# Altium schematic sheet AudioAmplifier.SchDoc
size A4
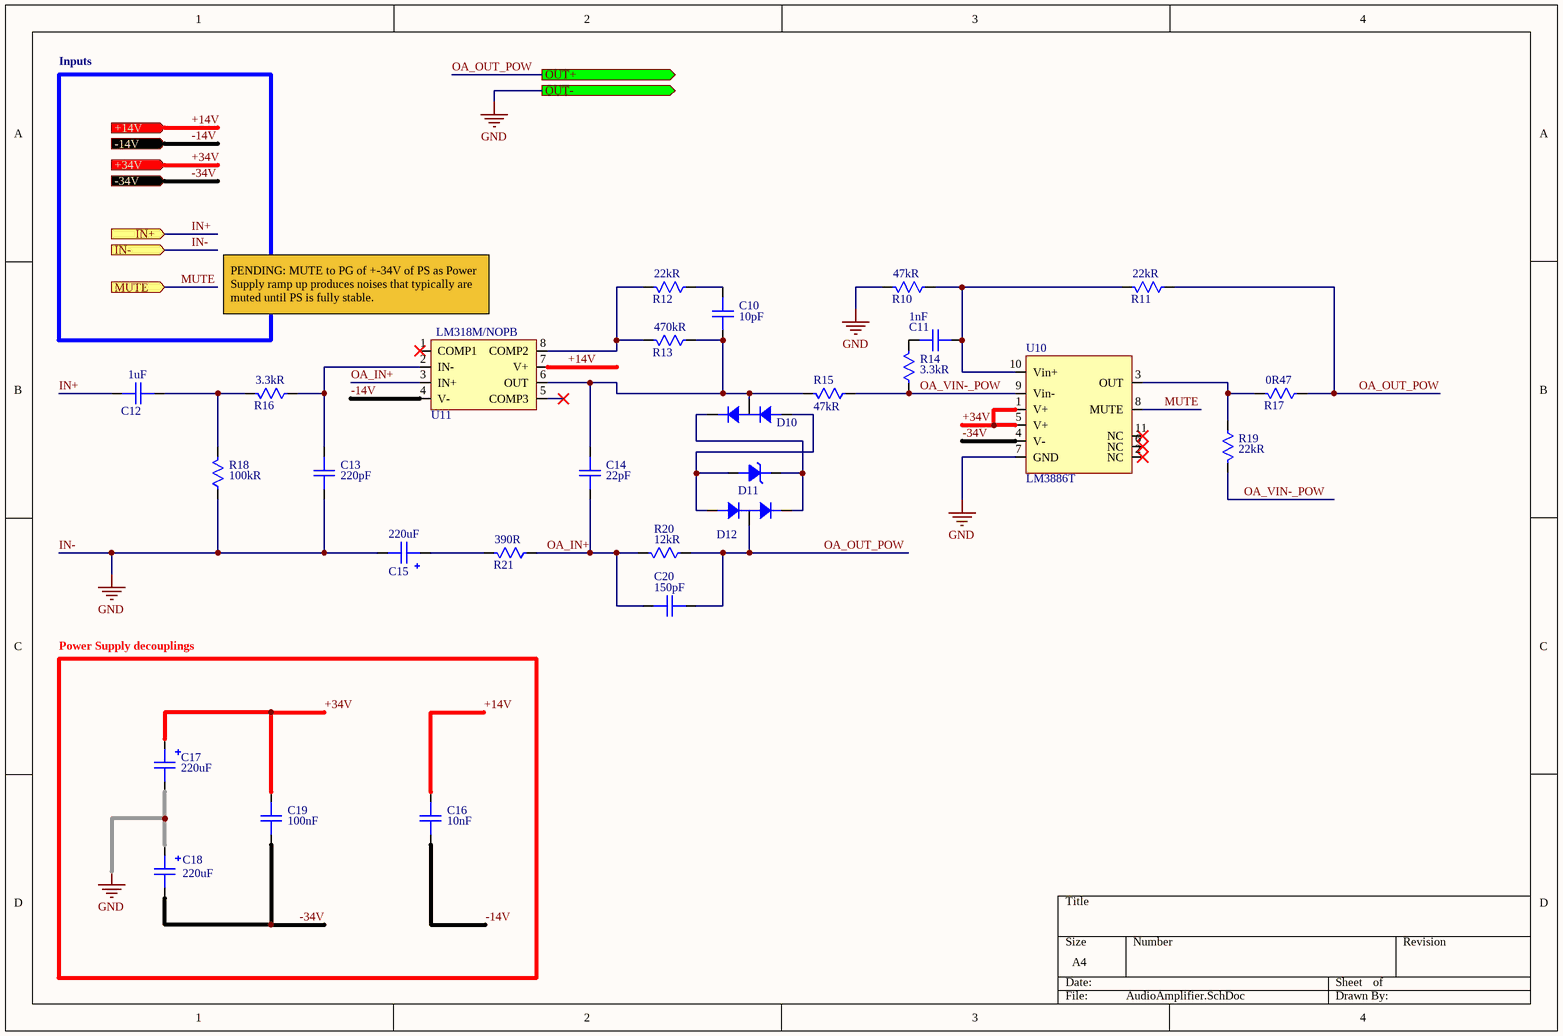
[diagram p0: AudioAmplifier.SchDoc]

## Parts
C10  Capacitance: 10pF  [CAPC2012X10N-GRM0805-MURATA]  (hidden comment: GRM21A5C2D100JW01D)
C11  Capacitance: 1nF  [CAPC2012X10N-GRM0805-MURATA]  (hidden comment: GRM219R72A102KA01D)
C12  Capacitance: 1uF  [Chip2PinSM127P600-8N-4030-SMD-PET-WIMA]  (hidden comment: SMDTC04100VA00KR00)
C13  Capacitance: 220pF  [CAPC2012X10N-GRM0805-MURATA]  (hidden comment: GRM219R72A221KA01D)
C14  Capacitance: 22pF  [CAPC2012X10N-GRM0805-MURATA]  (hidden comment: GRM21A5C2D220JW01D)
C15  Capacitance: 220uF  [Capacitor-KEMET-H4]  (hidden comment: ESH227M063AH4AA)
C16  Capacitance: 10nF  [CAPC2012X10N-GRM0805-MURATA]  (hidden comment: GRM219R72A103KA01D)
C17  Capacitance: 220uF  [Capacitor-KEMET-H4]  (hidden comment: ESH227M063AH4AA)
C18  Capacitance: 220uF  [Capacitor-KEMET-H4]  (hidden comment: ESH227M063AH4AA)
C19  Capacitance: 100nF  [CAPC2012X10N-GRM0805-MURATA]  (hidden comment: GRM21BR72A104KAC4L)
C20  Capacitance: 150pF  [CAPC2012X10N-GRM0805-MURATA]  (hidden comment: GRM2165C2A151JA01D)
D10  BAV99W,LF  [SOT65P210X100-3N-SOT-323-TOSHIBA]  (value not drawn)
D11  BZV55-C27,115  [DIOMELF3515N-SOD80C-NEXPERIA]  (value not drawn)
D12  BAV99W,LF  [SOT65P210X100-3N-SOT-323-TOSHIBA]  (value not drawn)
R10  Resistance: 47kR  [Chip2PinSM127P600-8N-RK73H-1206-KOA]  (hidden comment: RK73H2BTTD4702F)
R11  Resistance: 22kR  [Chip2PinSM127P600-8N-RK73H-1206-KOA]  (hidden comment: RK73B2BTTDD223J)
R12  Resistance: 22kR  [Chip2PinSM127P600-8N-RK73H-1206-KOA]  (hidden comment: RK73B2BTTDD223J)
R13  Resistance: 470kR  [Chip2PinSM127P600-8N-RK73H-1206-KOA]  (hidden comment: SG732BTTD474K)
R14  Resistance: 3.3kR  [Chip2PinSM127P600-8N-RK73H-1206-KOA]  (hidden comment: RK73B2BTTDD332J)
R15  Resistance: 47kR  [Chip2PinSM127P600-8N-RK73H-1206-KOA]  (hidden comment: RK73H2BTTD4702F)
R16  Resistance: 3.3kR  [Chip2PinSM127P600-8N-RK73H-1206-KOA]  (hidden comment: RK73B2BTTDD332J)
R17  Resistance: 0R47  [Chip2PinSM127P600-8N-RWS7-OHMITE]  (hidden comment: RWS7 R47 J T&R)
R18  Resistance: 100kR  [Chip2PinSM127P600-8N-RK73H-1206-KOA]  (hidden comment: RK73B2BTTDD104J)
R19  Resistance: 22kR  [Chip2PinSM127P600-8N-RK73H-1206-KOA]  (hidden comment: RK73B2BTTDD223J)
R20  Resistance: 12kR  [Chip2PinSM127P600-8N-RK73H-1206-KOA]  (hidden comment: RK73H2BTTD1202F)
R21  Resistance: 390R  [Chip2PinSM127P600-8N-RK73H-1206-KOA]  (hidden comment: RK73B2BTTDD391J)
U10  LM3886T  [TF11B]
U11  LM318M/NOPB  [SOIC127P600X175-8N-SOIC8-D0008A-TI]

## Blocks framed on the sheet
Power Supply decouplings: C16-C19

## Ports
+14V (in), +34V (in), -14V (in), -34V (in), IN+ (in), IN- (in), MUTE (in), OUT+ (out), OUT- (out)

## Nets
IN-: C13.1 C15.2 C17.2 C18.1 R10.1 R18.2 U10.7(GND) ; port IN-, port OUT-  [also labelled GND]
+14V: C16.2 U11.7(V+) ; port +14V
+34V: C17.1 C19.2 U10.1(V+) U10.5(V+) ; port +34V
-14V: C16.1 U11.4(V-) ; port -14V
-34V: C18.2 C19.1 U10.4(V-) ; port -34V
IN+: C12.2 ; port IN+
MUTE: U10.8(MUTE) ; port MUTE
OA_IN+: C14.2 C20.2 R20.1 R21.2 U11.3(IN+)
OA_OUT_POW: C20.1 D12.K1A2 R11.2 R17.2 R20.2 ; port OUT+
OA_VIN-_POW: R14.2 R15.2 R19.1 U10.9(Vin-)
NetC10_1: C10.1 C14.1 D10.K1A2 R13.2 R15.1 U11.6(OUT)
NetC10_2: C10.2 R12.2
NetC11_1: C11.1 R10.2 R11.1 U10.10(Vin+)
NetC11_2: C11.2 R14.1
NetC12_1: C12.1 R16.1 R18.1
NetC13_2: C13.2 R16.2 U11.2(IN-)
NetC15_1: C15.1 R21.1
NetD10_A1: D10.A1 D11.A D12.A1
NetD10_K2: D10.K2 D11.K D12.K2
NetR12_1: R12.1 R13.1 U11.8(COMP2)
NetR17_1: R17.1 R19.2 U10.3(OUT)

Not connected (* = marked no-connect by the designer): U10 2(NC)* 6(NC)* 11(NC)*; U11 1(COMP1)* 5(COMP3)*

## Notes on the sheet
- Inputs
- (near U11) PENDING: MUTE to PG of +-34V of PS as Power Supply ramp up produces noises that typically are muted until PS is fully stable.

## Library data of the parts
C10 = GRM21A5C2D100JW01D: Cap Ceramic 10pF 200V C0G 5% Pad SMD 0805 125C T/R; Manufacturer: Murata; Supplier 1: Arrow Electronics; Manufacturer Part Number: GRM21A5C2D100JW01D; RoHS: Yes; Category: Ceramic Capacitors; Stock 1: 3605; Pricing 1: 1=0.27880, 10=0.18960, 25=0.18290, 100=0.10650, 250=0.10520, 500=0.07580, 1000=0.06340, 3000=0.06300 (USD); Mount: Surface Mount; Case/Package: 0805; Min Operating Temperature: -55°C; Max Operating Temperature: 125°C; Packaging: Tape and Reel; Voltage Rating: 200V; Tolerance: 5%; Voltage Rating (DC): 200V; Dielectric: C0G; Length: 0.079inch; Width: 0.049inch; Thickness: 0.051inch; RoHS Compliant: Yes; ComponentLink1URL: https://search.murata.co.jp/Ceramy/image/img/A01X/G101/ENG/GRM21A5C2D100JW01-01.pdf?src-supplier=Digi-Key; ComponentLink1Description: https://search.murata.co.jp/Ceramy/image/img/A01X/G101/ENG/GRM21A5C2D100JW01-01.pdf?src-supplier=Digi-Key; ComponentLink2URL: http://search.murata.co.jp/Ceramy/image/img/A01X/G101/ENG/GRM21A5C2D100JW01-01.pdf?src-supplier=Digi-Key; ComponentLink2Description: http://search.murata.co.jp/Ceramy/image/img/A01X/G101/ENG/GRM21A5C2D100JW01-01.pdf?src-supplier=Digi-Key
C11 = GRM219R72A102KA01D: 0805 1 nF 100 V ±10 % Tolerance X7R Surface Mount Multilayer Ceramic Capacitor; Manufacturer: Murata; Voltage Rating: 100V; Tolerance: 10%; Dissipation Factor: 0.025%; Supplier 1: Arrow Electronics; Manufacturer Part Number: GRM219R72A102KA01D; RoHS: Yes; Category: Ceramic Capacitors; Stock 1: 2320; Pricing 1: 1=0.16850, 10=0.12550, 25=0.12080, 100=0.06030, 250=0.05970, 500=0.04130, 1000=0.03450 (USD); Mount: Surface Mount; Case/Package: 0805; Case Code (Metric): 2012; Case Code (Imperial): 0805; Material: Ceramic; Dielectric Material: Ceramic; Min Operating Temperature: -55°C; Max Operating Temperature: 125°C; Package Quantity: 4000; Packaging: Tape and Reel; Voltage Rating (DC): 100V; Dielectric: X7R; Termination: SMD/SMT; Voltage: 100V; Series: GRM; Construction: Flat; Length: 2mm; Width: 0.049inch; Height: 0.85mm; Thickness: 0.037inch; Depth: 1.25mm; Radiation Hardening: No; Lead Free: Lead Free; RoHS Compliant: Yes; ComponentLink1URL: https://datasheet.ciiva.com/5418/product-5418996.pdf?src-supplier=Mouser; ComponentLink1Description: https://datasheet.ciiva.com/5418/product-5418996.pdf?src-supplier=Mouser; ComponentLink2URL: https://datasheet.ciiva.com/29200/452953-da-01-en-vs-kondensator-0805-29200622.pdf?src-supplier=Conrad; ComponentLink2Description: https://datasheet.ciiva.com/29200/452953-da-01-en-vs-kondensator-0805-29200622.pdf?src-supplier=Conrad; ComponentLink3URL: https://datasheet.ciiva.com/166/partnumbering-e-01-166386.pdf?src-supplier=Digi-Key; ComponentLink3Description: https://datasheet.ciiva.com/166/partnumbering-e-01-166386.pdf?src-supplier=Digi-Key; ComponentLink4URL: https://datasheet.ciiva.com/11621/c02e-11621626.pdf?src-supplier=Avnet; ComponentLink4Description: https://datasheet.ciiva.com/11621/c02e-11621626.pdf?src-supplier=Avnet; ComponentLink5URL: https://datasheet.ciiva.com/2989/c02e-2989678.pdf?src-supplier=Avnet; ComponentLink5Description: https://datasheet.ciiva.com/2989/c02e-2989678.pdf?src-supplier=Avnet
C12 = SMDTC04100VA00KR00: Cap Film 1UF 10% 63VDC 4030; Manufacturer: WIMA; Voltage Rating: 63V; Voltage Rating (AC): 40V; Supplier 1: Mouser; Manufacturer Part Number: SMDTC04100VA00KR00; RoHS: Yes; Category: Film Capacitors; Stock 1: 709; Pricing 1: 1=1.62000, 10=1.29000, 50=1.29000, 100=0.96200, 1000=0.64100, 10000=0.55700 (USD); Case/Package: 4030; Min Operating Temperature: -55°C; Max Operating Temperature: 100°C; Package Quantity: 775; Packaging: Tape and Reel; Voltage Rating (DC): 63V; Tolerance: 10%; Termination: SMD/SMT; ComponentLink1URL: https://datasheet.ciiva.com/13373/wima-smd-pet-10719-13373865.pdf?src-supplier=Mouser; ComponentLink1Description: https://datasheet.ciiva.com/13373/wima-smd-pet-10719-13373865.pdf?src-supplier=Mouser
C13 = GRM219R72A221KA01D: Cap Ceramic 220pF 100V X7R 10% SMD 0805 125°C Paper T/R; Manufacturer: Murata; Supplier 1: Mouser; Manufacturer Part Number: GRM219R72A221KA01D; RoHS: Yes; Category: Ceramic Capacitors; Stock 1: 2206; Pricing 1: 1=0.23000, 10=0.15800, 50=0.15800, 100=0.08800, 1000=0.05300, 10000=0.03900 (USD); Mount: Surface Mount; Case/Package: 0805; Case Code (Metric): 2012; Case Code (Imperial): 0805; Min Operating Temperature: -55°C; Max Operating Temperature: 125°C; Packaging: Tape and Reel; Tolerance: 10%; Package Quantity: 4000; Voltage Rating: 100V; Voltage Rating (DC): 100V; Dielectric: X7R; Termination: SMD/SMT; Series: GRM; Construction: Flat; Length: 2mm; Width: 0.049inch; Height: 0.85mm; Thickness: 0.037inch; Depth: 1.25mm; Radiation Hardening: No; RoHS Compliant: Yes; ComponentLink1URL: https://datasheet.ciiva.com/167/partnumbering-e-01-167705.pdf?src-supplier=Digi-Key; ComponentLink1Description: https://datasheet.ciiva.com/167/partnumbering-e-01-167705.pdf?src-supplier=Digi-Key
C14 = GRM21A5C2D220JW01D: Cap Ceramic 22pF 200V C0G 5% SMD 0805 125°C Paper T/R; Manufacturer: Murata; Supplier 1: Arrow Electronics; Manufacturer Part Number: GRM21A5C2D220JW01D; RoHS: Yes; Category: Ceramic Capacitors; Stock 1: 2; Pricing 1: 1=0.04630 (USD); Mount: Surface Mount; Case/Package: 0805; Min Operating Temperature: -55°C; Max Operating Temperature: 125°C; Packaging: Tape and Reel; Voltage Rating: 200V; Tolerance: 5%; Voltage Rating (DC): 200V; Dielectric: C0G; Length: 0.079inch; Width: 0.049inch; Thickness: 0.051inch; RoHS Compliant: Yes; ComponentLink1URL: https://search.murata.co.jp/Ceramy/image/img/A01X/G101/ENG/GRM21A5C2D220JW01-01.pdf?src-supplier=Digi-Key; ComponentLink1Description: https://search.murata.co.jp/Ceramy/image/img/A01X/G101/ENG/GRM21A5C2D220JW01-01.pdf?src-supplier=Digi-Key; ComponentLink2URL: http://search.murata.co.jp/Ceramy/image/img/A01X/G101/ENG/GRM21A5C2D220JW01-01.pdf?src-supplier=Digi-Key; ComponentLink2Description: http://search.murata.co.jp/Ceramy/image/img/A01X/G101/ENG/GRM21A5C2D220JW01-01.pdf?src-supplier=Digi-Key
C15 C17 C18 = ESH227M063AH4AA: Cap, 220ΜF, 63V, 20%; Manufacturer: KEMET; Life (Hours): 2000Hour; Supplier 1: Mouser; Manufacturer Part Number: ESH227M063AH4AA; RoHS: Yes; Category: Aluminum Electrolytic Capacitors; Stock 1: 236; Pricing 1: 1=0.58000, 10=0.40900, 50=0.30900, 100=0.26900, 1000=0.26900, 10000=0.26900 (USD); Case/Package: Radial; Min Operating Temperature: -25°C; Max Operating Temperature: 105°C; Tolerance: 20%; Voltage Rating: 63V; Voltage Rating (DC): 63V; Diameter: 10mm; Height: 19mm; Lead Pitch: 5mm; REACH SVHC: No SVHC; RoHS Compliant: Yes; ComponentLink1URL: https://datasheet.ciiva.com/22620/1794402-22620869.pdf?src-supplier=Element14; ComponentLink1Description: https://datasheet.ciiva.com/22620/1794402-22620869.pdf?src-supplier=Element14
C16 = GRM219R72A103KA01D: Cap Ceramic 0.01uF 100V X7R 10% SMD 0805 125°C Paper T/R; Manufacturer: Murata; Supplier 1: Arrow Electronics; Manufacturer Part Number: GRM219R72A103KA01D; RoHS: Yes; Category: Ceramic Capacitors; Stock 1: 2008; Pricing 1: 1=0.19160, 10=0.16510, 25=0.16340, 100=0.07650, 250=0.07580, 500=0.05240, 1000=0.04340 (USD); Mount: Surface Mount; Case/Package: 0805; Case Code (Imperial): 0805; Case Code (Metric): 2012; Weight: 0.000335oz; Min Operating Temperature: -55°C; Max Operating Temperature: 125°C; Tolerance: 10%; Packaging: Tape and Reel; Dielectric: X7R; Voltage Rating: 100V; Termination: SMD/SMT; Resistor Type: Ceramic; Voltage Rating (DC): 100V; Package Quantity: 4000; Length: 2mm; Width: 0.049inch; Height: 0.85mm; Thickness: 0.037inch; Depth: 1.25mm; RoHS Compliant: Yes; ComponentLink1URL: http://www.mouser.com/ds/2/281/c02e-2905.pdf?src-supplier=Mouser; ComponentLink1Description: http://www.mouser.com/ds/2/281/c02e-2905.pdf?src-supplier=Mouser; ComponentLink2URL: https://search.murata.co.jp/Ceramy/image/img/A01X/G101/ENG/GRM219R72A103KA01-01.pdf?src-supplier=Digi-Key; ComponentLink2Description: https://search.murata.co.jp/Ceramy/image/img/A01X/G101/ENG/GRM219R72A103KA01-01.pdf?src-supplier=Digi-Key
C19 = GRM21BR72A104KAC4L: 0805 0.1 uF 100 V ±10% Tolerance X7R SMT Multilayer Ceramic Capacitor; Manufacturer: Murata; Voltage Rating: 100V; Dissipation Factor: 0.05%; Supplier 1: Arrow Electronics; Manufacturer Part Number: GRM21BR72A104KAC4L; RoHS: Yes; Category: Ceramic Capacitors; Stock 1: 15610; Pricing 1: 1=0.26170, 10=0.12880, 25=0.12760, 100=0.10330, 250=0.10110, 500=0.07210, 1000=0.06190, 3000=0.06120, 6000=0.06030, 15000=0.05530 (USD); Mount: Surface Mount; Case/Package: 0805; Case Code (Metric): 2012; Case Code (Imperial): 0805; Dielectric Material: Ceramic; Min Operating Temperature: -55°C; Max Operating Temperature: 125°C; Packaging: Tape and Reel; Tolerance: 10%; Dielectric: X7R; Voltage: 100V; Termination: SMD/SMT; Voltage Rating (DC): 100V; Series: GRM; Construction: Flat; Length: 2mm; Width: 0.049inch; Height: 1.25mm; Thickness: 0.053inch; Depth: 1.25mm; Lead Free: Lead Free; RoHS Compliant: Yes; ComponentLink1URL: http://search.murata.co.jp/Ceramy/image/img/A01X/G101/ENG/GRM21BR72A104KAC4-01.pdf?src-supplier=Digi-Key; ComponentLink1Description: http://search.murata.co.jp/Ceramy/image/img/A01X/G101/ENG/GRM21BR72A104KAC4-01.pdf?src-supplier=Digi-Key
C20 = GRM2165C2A151JA01D: Cap Ceramic 150pF 100V C0G 5% SMD 0805 125°C Paper T/R; Manufacturer: Murata; Temperature Coefficient: 30ppm/°C; Supplier 1: Arrow Electronics; Manufacturer Part Number: GRM2165C2A151JA01D; RoHS: Yes; Category: Ceramic Capacitors; Stock 1: 3713; Pricing 1: 1=0.17760, 10=0.12740, 25=0.12600, 100=0.06180, 250=0.06120, 500=0.04360, 1000=0.03530, 3000=0.03490 (USD); Mount: Surface Mount; Case/Package: 0805; Case Code (Imperial): 0805; Case Code (Metric): 2012; Material: Ceramic; Min Operating Temperature: -55°C; Max Operating Temperature: 125°C; Tolerance: 5%; Dielectric: C0G; Voltage Rating: 100V; Voltage Rating (DC): 100V; Packaging: Tape and Reel; Package Quantity: 1; Termination: SMD/SMT; Voltage: 100V; Series: GRM; Construction: Flat; Length: 2mm; Width: 1.25mm; Height: 0.6mm; Depth: 1.25mm; Thickness: 0.028inch; Radiation Hardening: No; Lead Free: Lead Free; RoHS Compliant: Yes; ComponentLink1URL: https://datasheet.ciiva.com/29201/452452-da-01-en-vs-kondensator-0805-29201254.pdf?src-supplier=Conrad; ComponentLink1Description: https://datasheet.ciiva.com/29201/452452-da-01-en-vs-kondensator-0805-29201254.pdf?src-supplier=Conrad; ComponentLink2URL: https://datasheet.ciiva.com/5419/product-5419669.pdf?src-supplier=Mouser; ComponentLink2Description: https://datasheet.ciiva.com/5419/product-5419669.pdf?src-supplier=Mouser; ComponentLink3URL: https://datasheet.ciiva.com/133/partnumbering-e-01-133927.pdf?src-supplier=Digi-Key; ComponentLink3Description: https://datasheet.ciiva.com/133/partnumbering-e-01-133927.pdf?src-supplier=Digi-Key; ComponentLink4URL: https://datasheet.ciiva.com/133/partnumbering-e-01-133928.pdf?src-supplier=Digi-Key; ComponentLink4Description: https://datasheet.ciiva.com/133/partnumbering-e-01-133928.pdf?src-supplier=Digi-Key; ComponentLink5URL: https://datasheet.ciiva.com/133/partnumbering-e-01-133929.pdf?src-supplier=Digi-Key; ComponentLink5Description: https://datasheet.ciiva.com/133/partnumbering-e-01-133929.pdf?src-supplier=Digi-Key; ComponentLink6URL: https://datasheet.ciiva.com/11617/product-11617453.pdf?src-supplier=Avnet; ComponentLink6Description: https://datasheet.ciiva.com/11617/product-11617453.pdf?src-supplier=Avnet
D10 D12 = BAV99W,LF: Switching Diode Series 0.9pF 100V 3-Pin SOT-323; pin to pad: A1>1 K1A2>3 K2>2; Manufacturer: Toshiba; Supplier 1: Mouser; Manufacturer Part Number: BAV99W,LF; RoHS: No; Category: Rectifier Diodes; Stock 1: 14403; Pricing 1: 1=0.22000, 10=0.20200, 50=0.20200, 100=0.11000, 1000=0.04700, 10000=0.03900 (USD)
D11 = BZV55-C27,115: Zener diode BZV55C27 Hottech; SMD; MiniMELF, LL-34 (SOD-80); 27V; 0, 5W; 5%; pin to pad: A>2 K>1; Manufacturer: Nexperia; Supplier 1: Digi-Key; Manufacturer Part Number: BZV55-C27,115; RoHS: Yes; Category: Zener Diodes; Stock 1: 153; Pricing 1: 1=0.19000, 10=0.17500, 100=0.09520, 500=0.05856, 1000=0.03993 (USD); RoHS Compliant: Yes; ComponentLink1URL: http://www.farnell.com/datasheets/1498690.pdf?src-supplier=Farnell; ComponentLink1Description: http://www.farnell.com/datasheets/1498690.pdf?src-supplier=Farnell; ComponentLink2URL: https://assets.nexperia.com/documents/data-sheet/BZV55_SER.pdf?src-supplier=Digi-Key; ComponentLink2Description: https://assets.nexperia.com/documents/data-sheet/BZV55_SER.pdf?src-supplier=Digi-Key
R10 R15 = RK73H2BTTD4702F: Res Thick Film 1206 47K Ohm 1% 0.25W(1/4W) ±100ppm/C Pad SMD Automotive T/R; Manufacturer: KOA Speer; Power Rating: 250mW; Voltage Rating: 200V; Temperature Coefficient: 100ppm/°C; Supplier 1: Digi-Key; Manufacturer Part Number: RK73H2BTTD4702F; RoHS: Yes; Category: Chip SMD Resistors; Stock 1: 20654; Pricing 1: 1=0.10000, 10=0.06000, 100=0.02440, 1000=0.01097, 2500=0.00952 (USD); Case/Package: Molded; Number of Pins: 2; Case Code (Imperial): 1206; Case Code (Metric): 3216; Min Operating Temperature: -55°C; Max Operating Temperature: 155°C; Tolerance: 1%; Packaging: Tape and Reel; Termination: SMD/SMT; Resistor Type: Thick Film; Voltage Rating (DC): 200V; Series: RK73H; Resistance Tolerance: 1%; REACH SVHC: No SVHC; Lead Free: Lead Free; RoHS Compliant: Yes; ComponentLink1URL: https://datasheet.ciiva.com/22681/549017-22681256.pdf?src-supplier=Element14; ComponentLink1Description: https://datasheet.ciiva.com/22681/549017-22681256.pdf?src-supplier=Element14; ComponentLink2URL: https://datasheet.ciiva.com/5554/rk73h-5554329.pdf?src-supplier=Mouser; ComponentLink2Description: https://datasheet.ciiva.com/5554/rk73h-5554329.pdf?src-supplier=Mouser; ComponentLink3URL: https://datasheet.ciiva.com/48426/rk73h-series-eng-jap-tds-48426457.pdf?src-supplier=Distrelec; ComponentLink3Description: https://datasheet.ciiva.com/48426/rk73h-series-eng-jap-tds-48426457.pdf?src-supplier=Distrelec
R11 R12 R19 = RK73B2BTTDD223J: Thick Film Resistors 1/4W 22K OHM 5%; Manufacturer: KOA Speer; Power Rating: 250mW; Voltage Rating: 200V; Temperature Coefficient: 200ppm/°C; Supplier 1: Mouser; Manufacturer Part Number: RK73B2BTTDD223J; RoHS: Yes; Category: Resistors; Stock 1: 4037; Pricing 1: 1=0.10000, 10=0.05300, 50=0.05300, 100=0.02200, 1000=0.01000, 10000=0.00600 (USD); Case/Package: 1206; Case Code (Imperial): 1206; Case Code (Metric): 3216; Min Operating Temperature: -55°C; Max Operating Temperature: 155°C; Tolerance: 5%; Packaging: Tape and Reel; Termination: SMD/SMT; Series: RK73B; Lead Free: Lead Free; RoHS Compliant: Yes; ComponentLink1URL: https://datasheet.ciiva.com/5557/rk73b-5557031.pdf?src-supplier=Mouser; ComponentLink1Description: https://datasheet.ciiva.com/5557/rk73b-5557031.pdf?src-supplier=Mouser
R13 = SG732BTTD474K: anti-surge thick film chip resistor, 1206, RoHS; Manufacturer: KOA Speer; Tolerance: 10%; Power Rating: 250mW; Voltage Rating: 200V; Temperature Coefficient: 200ppm/°C; Supplier 1: Mouser; Manufacturer Part Number: SG732BTTD474K; RoHS: Yes; Category: Chip SMD Resistors; Stock 1: 3298; Pricing 1: 1=0.34000, 10=0.29100, 50=0.29100, 100=0.11600, 1000=0.05500, 10000=0.03700 (USD); Case/Package: 1206; Case Code (Imperial): 1206; Case Code (Metric): 3216; Min Operating Temperature: -55°C; Max Operating Temperature: 155°C; Packaging: Tape and Reel; Termination: SMD/SMT; Voltage Rating (DC): 200V; Series: SG73; RoHS Compliant: Yes; ComponentLink1URL: https://datasheet.ciiva.com/5561/sg73-5561962.pdf?src-supplier=Mouser; ComponentLink1Description: https://datasheet.ciiva.com/5561/sg73-5561962.pdf?src-supplier=Mouser
R14 R16 = RK73B2BTTDD332J: Thick Film Resistors 3.3K OHM 5%; Manufacturer: KOA Speer; Power Rating: 250mW; Voltage Rating: 200V; Temperature Coefficient: 200ppm/°C; Supplier 1: Mouser; Manufacturer Part Number: RK73B2BTTDD332J; RoHS: Yes; Category: Resistors; Stock 1: 4172; Pricing 1: 1=0.10000, 10=0.05300, 50=0.05300, 100=0.02200, 1000=0.01000, 10000=0.00700 (USD); Case/Package: 1206; Case Code (Imperial): 1206; Case Code (Metric): 3216; Min Operating Temperature: -55°C; Max Operating Temperature: 155°C; Tolerance: 5%; Packaging: Tape and Reel; Termination: SMD/SMT; Lead Free: Lead Free; ComponentLink1URL: http://www.mouser.com/ds/2/219/RK73B-919.pdf?src-supplier=Mouser; ComponentLink1Description: http://www.mouser.com/ds/2/219/RK73B-919.pdf?src-supplier=Mouser
R17 = RWS7 R47 J T&R: 7 Watts Wirewound SMD 470 Milliohms 5% Tape Reel / ARCOL; Manufacturer: Ohmite; Supplier 1: Mouser; Manufacturer Part Number: RWS7 R47 J T&R; RoHS: Yes; Stock 1: 192; Pricing 1: 1=2.23000, 10=2.04000, 50=1.92000, 100=1.52000, 1000=0.92700, 10000=0.90000 (USD)
R18 = RK73B2BTTDD104J: Thick Film Resistors - SMD 1/4watts 100Kohms 5%; Manufacturer: KOA Speer; Power Rating: 250mW; Voltage Rating: 200V; Temperature Coefficient: 200ppm/°C; Supplier 1: Mouser; Manufacturer Part Number: RK73B2BTTDD104J; RoHS: Yes; Category: Resistors; Stock 1: 4533; Pricing 1: 1=0.10000, 10=0.05300, 50=0.05300, 100=0.02200, 1000=0.01000, 10000=0.00900 (USD); Case/Package: 1206; Case Code (Imperial): 1206; Case Code (Metric): 3216; Min Operating Temperature: -55°C; Max Operating Temperature: 155°C; Tolerance: 5%; Packaging: Tape and Reel; Package Quantity: 10000; Resistor Type: Thick Film; Termination: SMD/SMT; Length: 3.2mm; Width: 1.6mm; Height: 0.6mm; Lead Free: Lead Free; ComponentLink1URL: https://datasheet.ciiva.com/5557/rk73b-5557336.pdf?src-supplier=Mouser; ComponentLink1Description: https://datasheet.ciiva.com/5557/rk73b-5557336.pdf?src-supplier=Mouser
R20 = RK73H2BTTD1202F: Res Thick Film 1206 12K Ohm 1% 0.25W(1/4W) ±100ppm/C Pad SMD Automotive T/R; Manufacturer: KOA Speer; Power Rating: 250mW; Voltage Rating: 200V; Temperature Coefficient: 100ppm/°C; Supplier 1: Farnell; Manufacturer Part Number: RK73H2BTTD1202F; RoHS: Yes; Category: Chip SMD Resistors; Stock 1: 50; Pricing 1: 10=0.06000, 100=0.02500, 500=0.01800, 1000=0.01100, 2500=0.01000, 5000=0.00600, 25000=0.00590 (EUR); Case/Package: 1206; Number of Pins: 2; Case Code (Imperial): 1206; Case Code (Metric): 3216; Min Operating Temperature: -55°C; Max Operating Temperature: 155°C; Tolerance: 1%; Packaging: Tape and Reel; Package Quantity: 5000; Resistor Type: Thick Film; Termination: SMD/SMT; Voltage Rating (DC): 200V; Series: RK73H; Resistance Tolerance: 1%; Length: 3.2mm; Width: 1.6mm; Height: 0.6mm; Lead Free: Lead Free; RoHS Compliant: Yes; ComponentLink1URL: https://datasheet.ciiva.com/5554/rk73h-5554649.pdf?src-supplier=Mouser; ComponentLink1Description: https://datasheet.ciiva.com/5554/rk73h-5554649.pdf?src-supplier=Mouser; ComponentLink2URL: https://datasheet.ciiva.com/7763/549017-7763194.pdf?src-supplier=Element14; ComponentLink2Description: https://datasheet.ciiva.com/7763/549017-7763194.pdf?src-supplier=Element14
R21 = RK73B2BTTDD391J: Thick Film Resistors - SMD 1/4W 390 OHM 5%; Manufacturer: KOA Speer; Power Rating: 250mW; Voltage Rating: 200V; Temperature Coefficient: 200ppm/°C; Supplier 1: Mouser; Manufacturer Part Number: RK73B2BTTDD391J; RoHS: Yes; Category: Chip SMD Resistors; Stock 1: 1283; Pricing 1: 1=0.10000, 10=0.05300, 50=0.05300, 100=0.02200, 1000=0.01000, 10000=0.00600 (USD); Case/Package: 1206; Case Code (Imperial): 1206; Case Code (Metric): 3216; Min Operating Temperature: -55°C; Max Operating Temperature: 155°C; Packaging: Tape and Reel; Package Quantity: 10000; Tolerance: 5%; Termination: SMD/SMT; Resistor Type: Thick Film; Series: RK73B; Length: 3.2mm; Width: 1.6mm; Height: 0.6mm; Lead Free: Lead Free; RoHS Compliant: Yes; ComponentLink1URL: http://www.koaspeer.com/catimages/Products/RK73B/RK73B.pdf?src-supplier=Mouser; ComponentLink1Description: http://www.koaspeer.com/catimages/Products/RK73B/RK73B.pdf?src-supplier=Mouser
U10 = LM3886T: Audio Amp Speaker 1-CH Mono 68W Class-AB 11-Pin(11+Tab) TO-220 Rail; Manufacturer: TI National Semiconductor; Voltage Gain: 115dB; Min Supply Voltage: 20V; Max Supply Voltage: 84V; Min Dual Supply Voltage: 10V; Max Dual Supply Voltage: 42V; Gain Bandwidth Product: 8MHz; Power Supply Rejection Ratio (PSRR): 120dB; Common Mode Rejection Ratio: 85dB; Max Power Dissipation: 125W; Number of Channels: 1; Input Offset Voltage (Vos): 10mV; Input Bias Current: 1uA; Quiescent Current: 85mA; Supply Type: Single,Dual; Load Impedance: 8R; Max Output Current: 11.5A; Dual Supply Voltage: 28V; Supplier 1: Farnell; Manufacturer Part Number: LM3886T; RoHS: No; Category: Amplifiers - Op Amps, Buffer, Instrumentation; Pricing 1: 1=6.53000, 10=5.38000, 25=4.98000, 50=4.72000, 100=4.45000, 250=4.23000, 500=3.38000 (EUR); Mount: Through Hole; Case/Package: TO-220; Number of Pins: 11; Weight: 0.01lb; Min Operating Temperature: -20°C; Max Operating Temperature: 85°C; Output Power: 68W; Packaging: Rail/Tube; Package Quantity: 20; Unity Gain Bandwidth Product: 8MHz; Max Output Power: 68W; Power Dissipation: 125W; Output Current: 11.5A; Series: Overture™; Length: 20.02mm; Width: 4.5mm; Height: 10.69mm; Radiation Hardening: No; REACH SVHC: No SVHC; RoHS Compliant: No; ComponentLink1URL: https://datasheet.ciiva.com/1480/21456-1480999.pdf?src-supplier=Element14; ComponentLink1Description: https://datasheet.ciiva.com/1480/21456-1480999.pdf?src-supplier=Element14; ComponentLink2URL: https://datasheet.ciiva.com/26842/lm3886t-26842547.pdf?src-supplier=IIIC; ComponentLink2Description: https://datasheet.ciiva.com/26842/lm3886t-26842547.pdf?src-supplier=IIIC; Supplier Part Number 1: 9493603
U11 = LM318M/NOPB: LM318-N Single 40V, 15MHZ, High; Manufacturer: TI National Semiconductor; Max Supply Voltage: 20V; Min Dual Supply Voltage: 5V; Max Power Dissipation: 500mW; Voltage Gain: 106.02dB; Nominal Supply Current: 10mA; Number of Channels: 1; Input Bias Current: 500nA; Input Offset Voltage (Vos): 4mV; Slew Rate: 70V/µs; Common Mode Rejection Ratio: 70dB; Operating Supply Current: 5mA; Output Current: 20mA; Amplifier Type: GENERAL PURPOSE; Supplier 1: Digi-Key; Manufacturer Part Number: LM318M/NOPB; RoHS: Yes; Category: Amplifiers - Op Amps, Buffer, Instrumentation; Stock 1: 575; Pricing 1: 1=1.57000, 10=1.41300, 25=1.33280, 100=1.13550, 250=1.06620, 500=0.93294, 1000=0.88013 (USD); Mount: Surface Mount; Case/Package: SOIC; Number of Pins: 8; Contact Plating: Tin,Matte; Min Operating Temperature: 0°C; Max Operating Temperature: 70°C; Package Quantity: 95; Packaging: Rail/Tube; Max Dual Supply Voltage: 20V; Number of Elements: 1; Power Dissipation: 500mW; Max Supply Current: 10mA; Supply Current: 10mA; Technology: BIPOLAR; Operating Supply Voltage: 20V; -3db Bandwidth: 15MHz; Number of Circuits: 1; Gain Bandwidth Product: 15MHz; Length: 5mm; Width: 4mm; Height: 1.5mm; Radiation Hardening: No; Lead Free: Lead Free; RoHS Compliant: Yes; ComponentLink1URL: https://datasheet.ciiva.com/25629/0900766b810fa293-25629045.pdf?src-supplier=RSComponents; ComponentLink1Description: https://datasheet.ciiva.com/25629/0900766b810fa293-25629045.pdf?src-supplier=RSComponents; ComponentLink2URL: https://datasheet.ciiva.com/19472/838031-19472597.pdf?src-supplier=Jameco; ComponentLink2Description: https://datasheet.ciiva.com/19472/838031-19472597.pdf?src-supplier=Jameco; ComponentLink3URL: https://datasheet.ciiva.com/14151/oelmx18-data-e-14151388.pdf?src-supplier=Distrelec; ComponentLink3Description: https://datasheet.ciiva.com/14151/oelmx18-data-e-14151388.pdf?src-supplier=Distrelec; ComponentLink4URL: https://datasheet.ciiva.com/2973/lm118-n-2973325.pdf?src-supplier=Avnet; ComponentLink4Description: https://datasheet.ciiva.com/2973/lm118-n-2973325.pdf?src-supplier=Avnet; ComponentLink5URL: https://datasheet.ciiva.com/6626/lm118-n-6626485.pdf?src-supplier=Digi-Key; ComponentLink5Description: https://datasheet.ciiva.com/6626/lm118-n-6626485.pdf?src-supplier=Digi-Key; ComponentLink6URL: https://datasheet.ciiva.com/48712/001010733-da-01-en-ic-op-amp-hi-slew-lm318m-nopb-soic-8-tid-48712454.pdf?src-supplier=Conrad; ComponentLink6Description: https://datasheet.ciiva.com/48712/001010733-da-01-en-ic-op-amp-hi-slew-lm318m-nopb-soic-8-tid-48712454.pdf?src-supplier=Conrad